# Altium schematic sheet Main.SchDoc
size A4; SheetNumber: 1; SheetTotal: 6
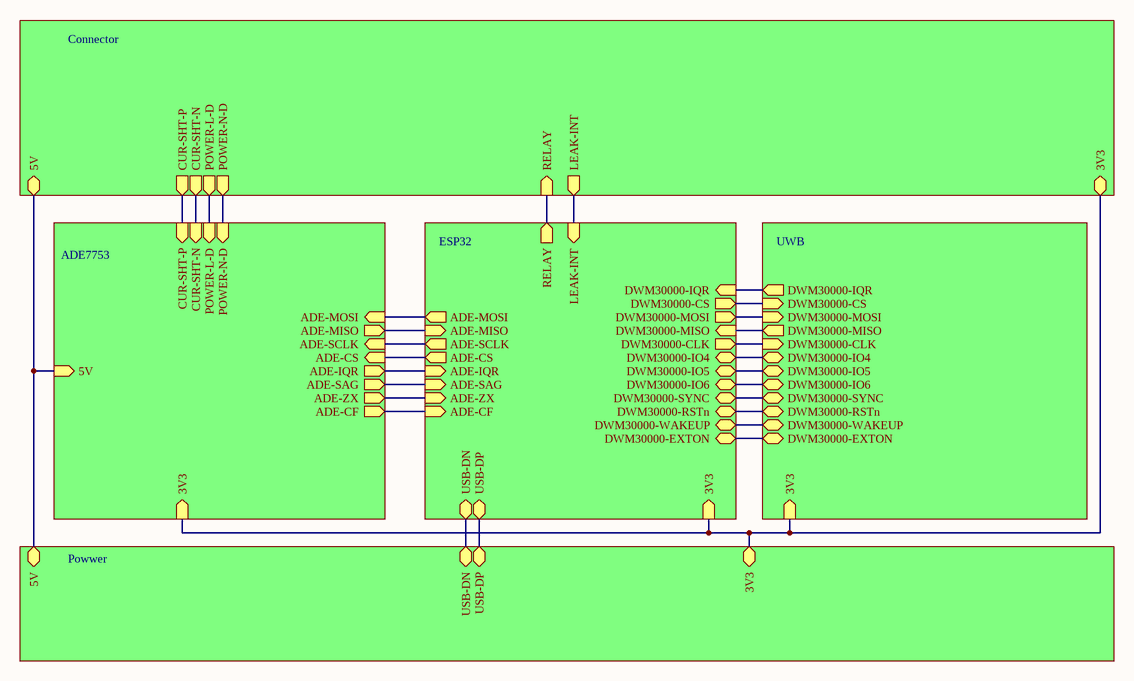
[diagram p0: Main.SchDoc]

## Sub-sheets
ADE7753 = ADE7753.SchDoc: ADE-MOSI (in), ADE-MISO (out), ADE-SCLK (in), ADE-CS (in), ADE-IQR (out), ADE-SAG (out), ADE-ZX (out), ADE-CF (out), CUR-SHT-P (in), CUR-SHT-N (in), POWER-L-D (in), POWER-N-D (in), 5V (in), 3V3 (in)
Connector = Connector.SchDoc: RELAY (in), LEAK-INT (out), 3V3 (bidir), 5V (bidir), CUR-SHT-P (out), CUR-SHT-N (out), POWER-L-D (out), POWER-N-D (out)
ESP32 = ESP32.SchDoc: DWM30000-CS (out), DWM30000-MOSI (out), DWM30000-MISO (in), DWM30000-CLK (out), DWM30000-IO4 (bidir), DWM30000-IO5 (bidir), DWM30000-IO6 (bidir), DWM30000-SYNC (bidir), DWM30000-RSTn (bidir), DWM30000-WAKEUP (bidir), DWM30000-EXTON (bidir), ADE-MOSI (out), ADE-MISO (in), ADE-SCLK (out), ADE-CS (out), ADE-IQR (in), ADE-SAG (in), ADE-ZX (in), ADE-CF (in), RELAY (out), USB-DN (bidir), USB-DP (bidir), 3V3 (in), LEAK-INT (in), DWM30000-IQR (in)
Powwer = Power.SchDoc: USB-DN (bidir), USB-DP (bidir), 3V3 (bidir), 5V (bidir)
UWB = UWB.SchDoc: DWM30000-CS (in), DWM30000-MOSI (in), DWM30000-MISO (out), DWM30000-CLK (in), DWM30000-IO4 (bidir), DWM30000-IO5 (bidir), DWM30000-IO6 (bidir), DWM30000-SYNC (bidir), DWM30000-RSTn (bidir), DWM30000-WAKEUP (bidir), DWM30000-EXTON (bidir), 3V3 (in), DWM30000-IQR (out)

## Nets
(unnamed): sheet ADE7753/ADE-MOSI, sheet ESP32/ADE-MOSI
(unnamed): sheet ADE7753/ADE-MISO, sheet ESP32/ADE-MISO
(unnamed): sheet ADE7753/ADE-SCLK, sheet ESP32/ADE-SCLK
(unnamed): sheet ADE7753/ADE-CS, sheet ESP32/ADE-CS
(unnamed): sheet ADE7753/ADE-IQR, sheet ESP32/ADE-IQR
(unnamed): sheet ADE7753/ADE-SAG, sheet ESP32/ADE-SAG
(unnamed): sheet ADE7753/ADE-ZX, sheet ESP32/ADE-ZX
(unnamed): sheet ADE7753/ADE-CF, sheet ESP32/ADE-CF
(unnamed): sheet ADE7753/CUR-SHT-P, sheet Connector/CUR-SHT-P
(unnamed): sheet ADE7753/CUR-SHT-N, sheet Connector/CUR-SHT-N
(unnamed): sheet ADE7753/POWER-L-D, sheet Connector/POWER-L-D
(unnamed): sheet ADE7753/POWER-N-D, sheet Connector/POWER-N-D
(unnamed): sheet ADE7753/5V, sheet Powwer/5V, sheet Connector/5V
(unnamed): sheet ADE7753/3V3, sheet Powwer/3V3, sheet ESP32/3V3, sheet UWB/3V3, sheet Connector/3V3
(unnamed): sheet Powwer/USB-DN, sheet ESP32/USB-DN
(unnamed): sheet Powwer/USB-DP, sheet ESP32/USB-DP
(unnamed): sheet ESP32/DWM30000-CS, sheet UWB/DWM30000-CS
(unnamed): sheet ESP32/DWM30000-MOSI, sheet UWB/DWM30000-MOSI
(unnamed): sheet ESP32/DWM30000-MISO, sheet UWB/DWM30000-MISO
(unnamed): sheet ESP32/DWM30000-CLK, sheet UWB/DWM30000-CLK
(unnamed): sheet ESP32/DWM30000-IO4, sheet UWB/DWM30000-IO4
(unnamed): sheet ESP32/DWM30000-IO5, sheet UWB/DWM30000-IO5
(unnamed): sheet ESP32/DWM30000-IO6, sheet UWB/DWM30000-IO6
(unnamed): sheet ESP32/DWM30000-SYNC, sheet UWB/DWM30000-SYNC
(unnamed): sheet ESP32/DWM30000-RSTn, sheet UWB/DWM30000-RSTn
(unnamed): sheet ESP32/DWM30000-WAKEUP, sheet UWB/DWM30000-WAKEUP
(unnamed): sheet ESP32/DWM30000-EXTON, sheet UWB/DWM30000-EXTON
(unnamed): sheet ESP32/RELAY, sheet Connector/RELAY
(unnamed): sheet ESP32/LEAK-INT, sheet Connector/LEAK-INT
(unnamed): sheet ESP32/DWM30000-IQR, sheet UWB/DWM30000-IQR